# EAGLE design connector_board (EAGLE 7.7.0)
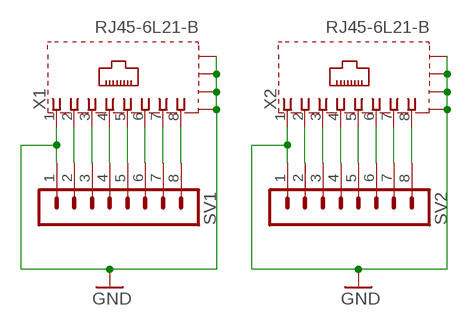
[diagram p0: schematic, sheet 1]

## Parts
SV1  MA08-1  [MA08-1]
SV2  MA08-1  [MA08-1]
X1  RJ45-6L21-B  [RJ45-SHIELD1]
X2  RJ45-6L21-B  [RJ45-SHIELD1]

## Nets
GND: SV1.1 SV2.1 X1.1 X1.S1(S) X1.S2(S) X1.S3(S) X1.S4(S) X2.1 X2.S1(S) X2.S2(S) X2.S3(S) X2.S4(S)
N$3: SV1.3 X1.3
N$4: SV1.4 X1.4
N$5: SV1.5 X1.5
N$6: SV1.6 X1.6
N$7: SV1.7 X1.7
N$8: SV1.8 X1.8
N$11: SV2.3 X2.3
N$12: SV2.4 X2.4
N$13: SV2.5 X2.5
N$14: SV2.6 X2.6
N$15: SV2.7 X2.7
N$16: SV2.8 X2.8
N$19: SV1.2 X1.2
N$20: SV2.2 X2.2

## Library data of the parts
SV1 SV2 = con-lstb:MA08-1: PIN HEADER; OC_FARNELL: unknown; OC_NEWARK: unknown
X1 X2 = con-tycoelectronics:RJ45*2: RJ45 Low Profile Shield Type 2 For all RJ45 L, LC, LCT and X Series Models Source: www.tycoelectronics.com .. ENG_DS_1654001_1099_RJ_L_0507.pdf; OC_FARNELL: unknown; OC_NEWARK: unknown

## Board
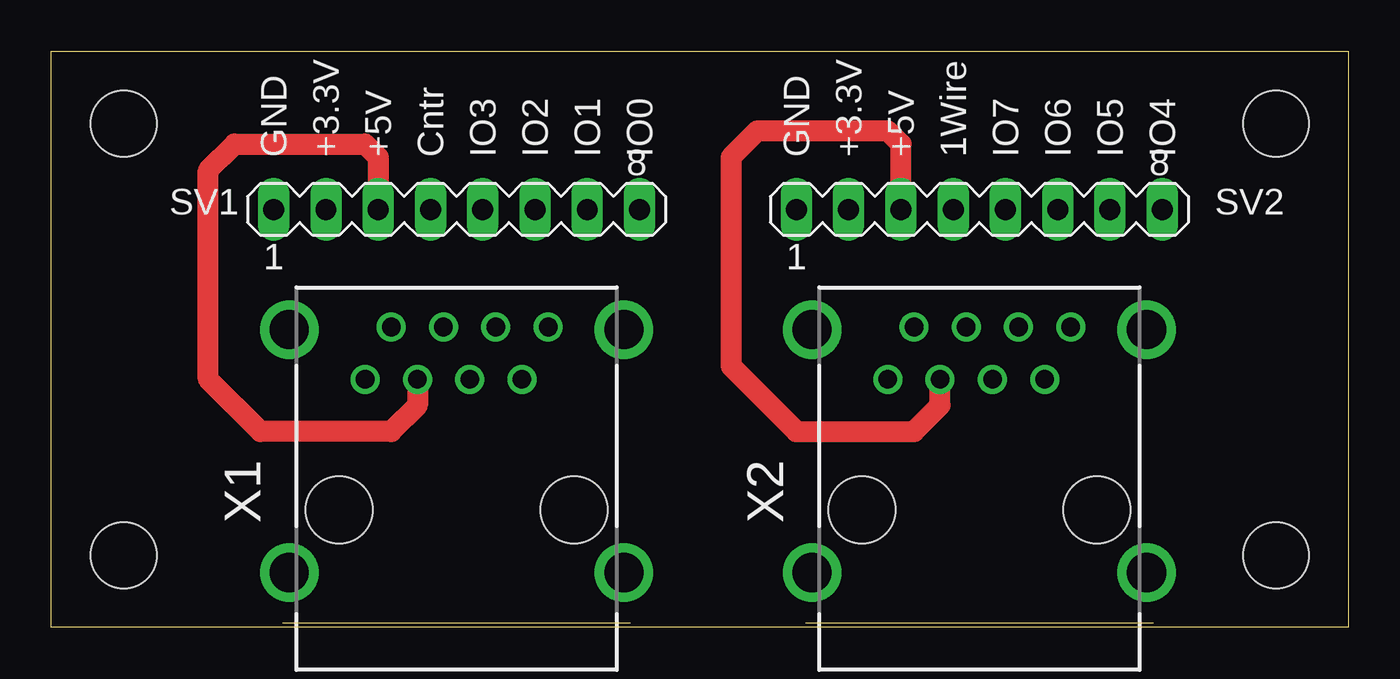
[diagram p1: board, top side]
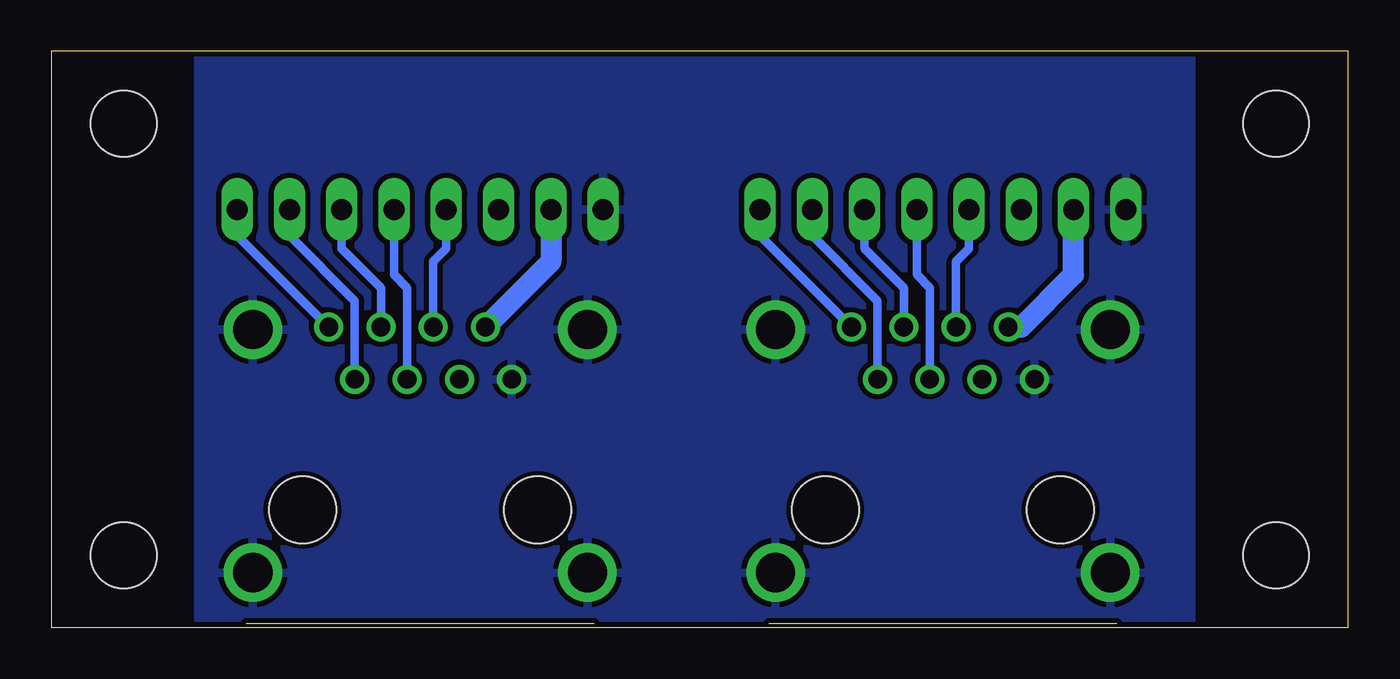
[diagram p2: board, bottom side, seen from below]

Size 63 x 28 mm. Coordinates in mm from the lower left corner, seen from the top.
Outline: 0,0 0,28 63,28 63,0 0,0
Copper layers (1*16): Top 0.035mm / dielectric 1.5mm / Bottom 0.035mm
Design rules "JLCPCB": minimum track width 5mil, minimum drill 12mil, track to track 5mil, track to pad 5mil, pad to pad 5mil, via to via 5mil, smd to smd 0mil, copper to edge 10mil, drill to drill 10mil, minimum pad ring 10mil, minimum via ring 6mil, stop-mask expansion 2mil, vias tented up to drill 25mil, thermal gap 10mil
Holes 3.2 mm at 3.5,3.5 3.5,24.5 59.5,24.5 59.5,3.5

### Footprints (pad centres in the part's own frame; a part is rotated, then mirrored left to right if it is on the bottom)
MA08-1 = drill 1.016 long: 1 -8.89,0; 2 -6.35,0; 3 -3.81,0; 4 -1.27,0; 5 1.27,0; 6 3.81,0; 7 6.35,0; 8 8.89,0
RJ45-SHIELD1 = drill 0.9 pad 1.4: 1 -4.445,6.35; 2 -3.175,8.89; 3 -1.905,6.35; 4 -0.635,8.89; 5 0.635,6.35; 6 1.905,8.89; 7 3.175,6.35; 8 4.445,8.89 | drill 1.9 pad 2.5: S1 -8.128,-3.048; S2 8.128,-3.048; S3 -8.128,8.76; S4 8.128,8.76 | hole 3.251: -5.715,0; 5.715,0

### Placement (x,y rotation side)
SV1  19.68,20.32 0 top
SV2  45.09,20.32 0 top
X1  19.68,5.71 0 top
X2  45.09,5.71 0 top

### Tracks (layer width: path | path; a pad name or v marks a point on that pad's centre or on a via)
GND
  pour Bottom (isolate 0.254): 7.62,27.94 7.62,0 55.88,0 55.88,27.94
N$3
  Top 1.016: X1.3 17.78,10.79 16.51,9.53 10.16,9.53 7.62,12.06 7.62,22.23 8.89,23.5 15.24,23.5 15.88,22.86 SV1.3
N$4
  Bottom 0.406: X1.4 19.05,17.78 18.41,18.41 SV1.4
N$5
  Bottom 0.406: SV1.5 20.95,17.14 20.32,16.51 X1.5
N$6
  Bottom 0.406: X1.6 21.59,16.51 23.5,18.41 SV1.6
N$7
  Bottom 0.406: X1.7 22.86,15.88 26.04,19.05 SV1.7
N$8
  Bottom 0.406: SV1.8 28.57,19.05 X1.8
N$11
  Top 1.016: SV2.3 41.27,23.5 40.64,24.13 34.29,24.13 33.02,22.86 33.02,12.7 36.2,9.53 41.91,9.53 43.18,10.79 X2.3
N$12
  Bottom 0.406: SV2.4 43.81,18.41 44.45,17.78 X2.4
N$13
  Bottom 0.406: X2.5 45.72,16.51 46.35,17.14 SV2.5
N$14
  Bottom 0.406: X2.6 46.99,16.51 48.9,18.41 SV2.6
N$15
  Bottom 0.406: X2.7 48.26,15.88 51.44,19.05 SV2.7
N$16
  Bottom 0.406: X2.8 53.98,19.05 SV2.8
N$19
  Bottom 1.016: X1.2 15.88,14.61 13.34,17.14 SV1.2
N$20
  Bottom 1.016: SV2.2 38.73,17.78 X2.2

### Text on the board
tNames: GND | +3.3V | +5V | Cntr | IO3 | IO2 | IO1 | IO0 | GND | +3.3V | +5V | 1Wire | IO7 | IO6 | IO5 | IO4